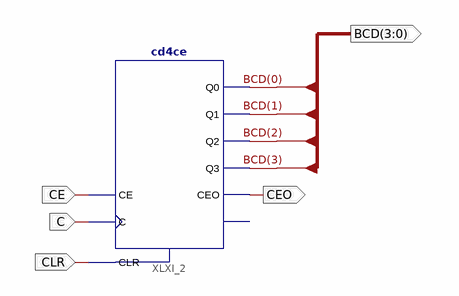
[diagram p0: schematic sheet 1]
// Xilinx ISE schematic Counter10BCD.sch (spartan6) as structural Verilog: 1 symbols, 5 ports
module Counter10BCD (
  input  CE,
  input  C,
  input  CLR,
  output CEO,
  output [3:0] BCD
);

  cd4ce XLXI_2 (.C(C), .CE(CE), .CLR(CLR), .CEO(CEO), .Q0(BCD[0]), .Q1(BCD[1]), .Q2(BCD[2]), .Q3(BCD[3]));  // open: TC
endmodule
